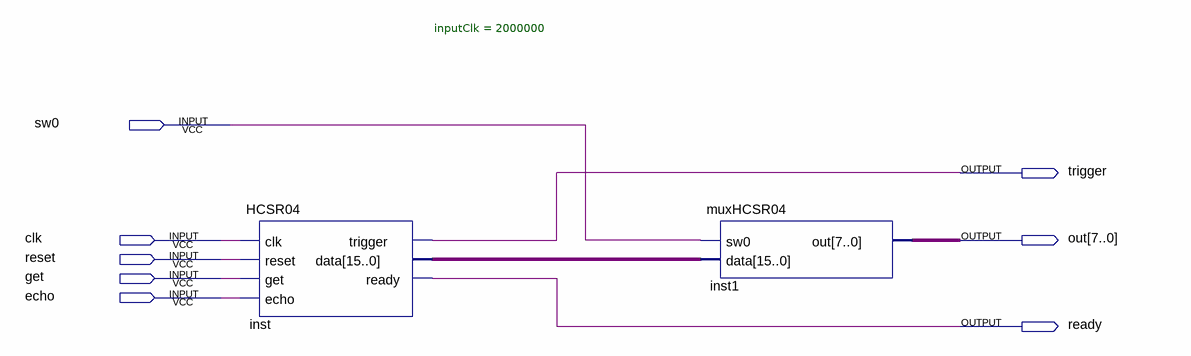
[diagram p0: schematic sheet]
// Quartus schematic scheme.bdf as structural Verilog: 2 symbols, 8 pins
module scheme (
  input  sw0,
  input  clk,
  input  reset,
  input  get,
  input  echo,
  output trigger,
  output [7:0] out,
  output ready
);

  wire [15:0] inst_data;

  HCSR04 #(.inputClk(2000000)) inst (
    .clk(clk), .reset(reset), .get(get), .echo(echo), .trigger(trigger), .data(inst_data), .ready(ready));
  muxHCSR04 inst1 (.sw0(sw0), .data(inst_data), .out(out));
endmodule
